# EAGLE design emonBike v0.2 (EAGLE 7.7.0)
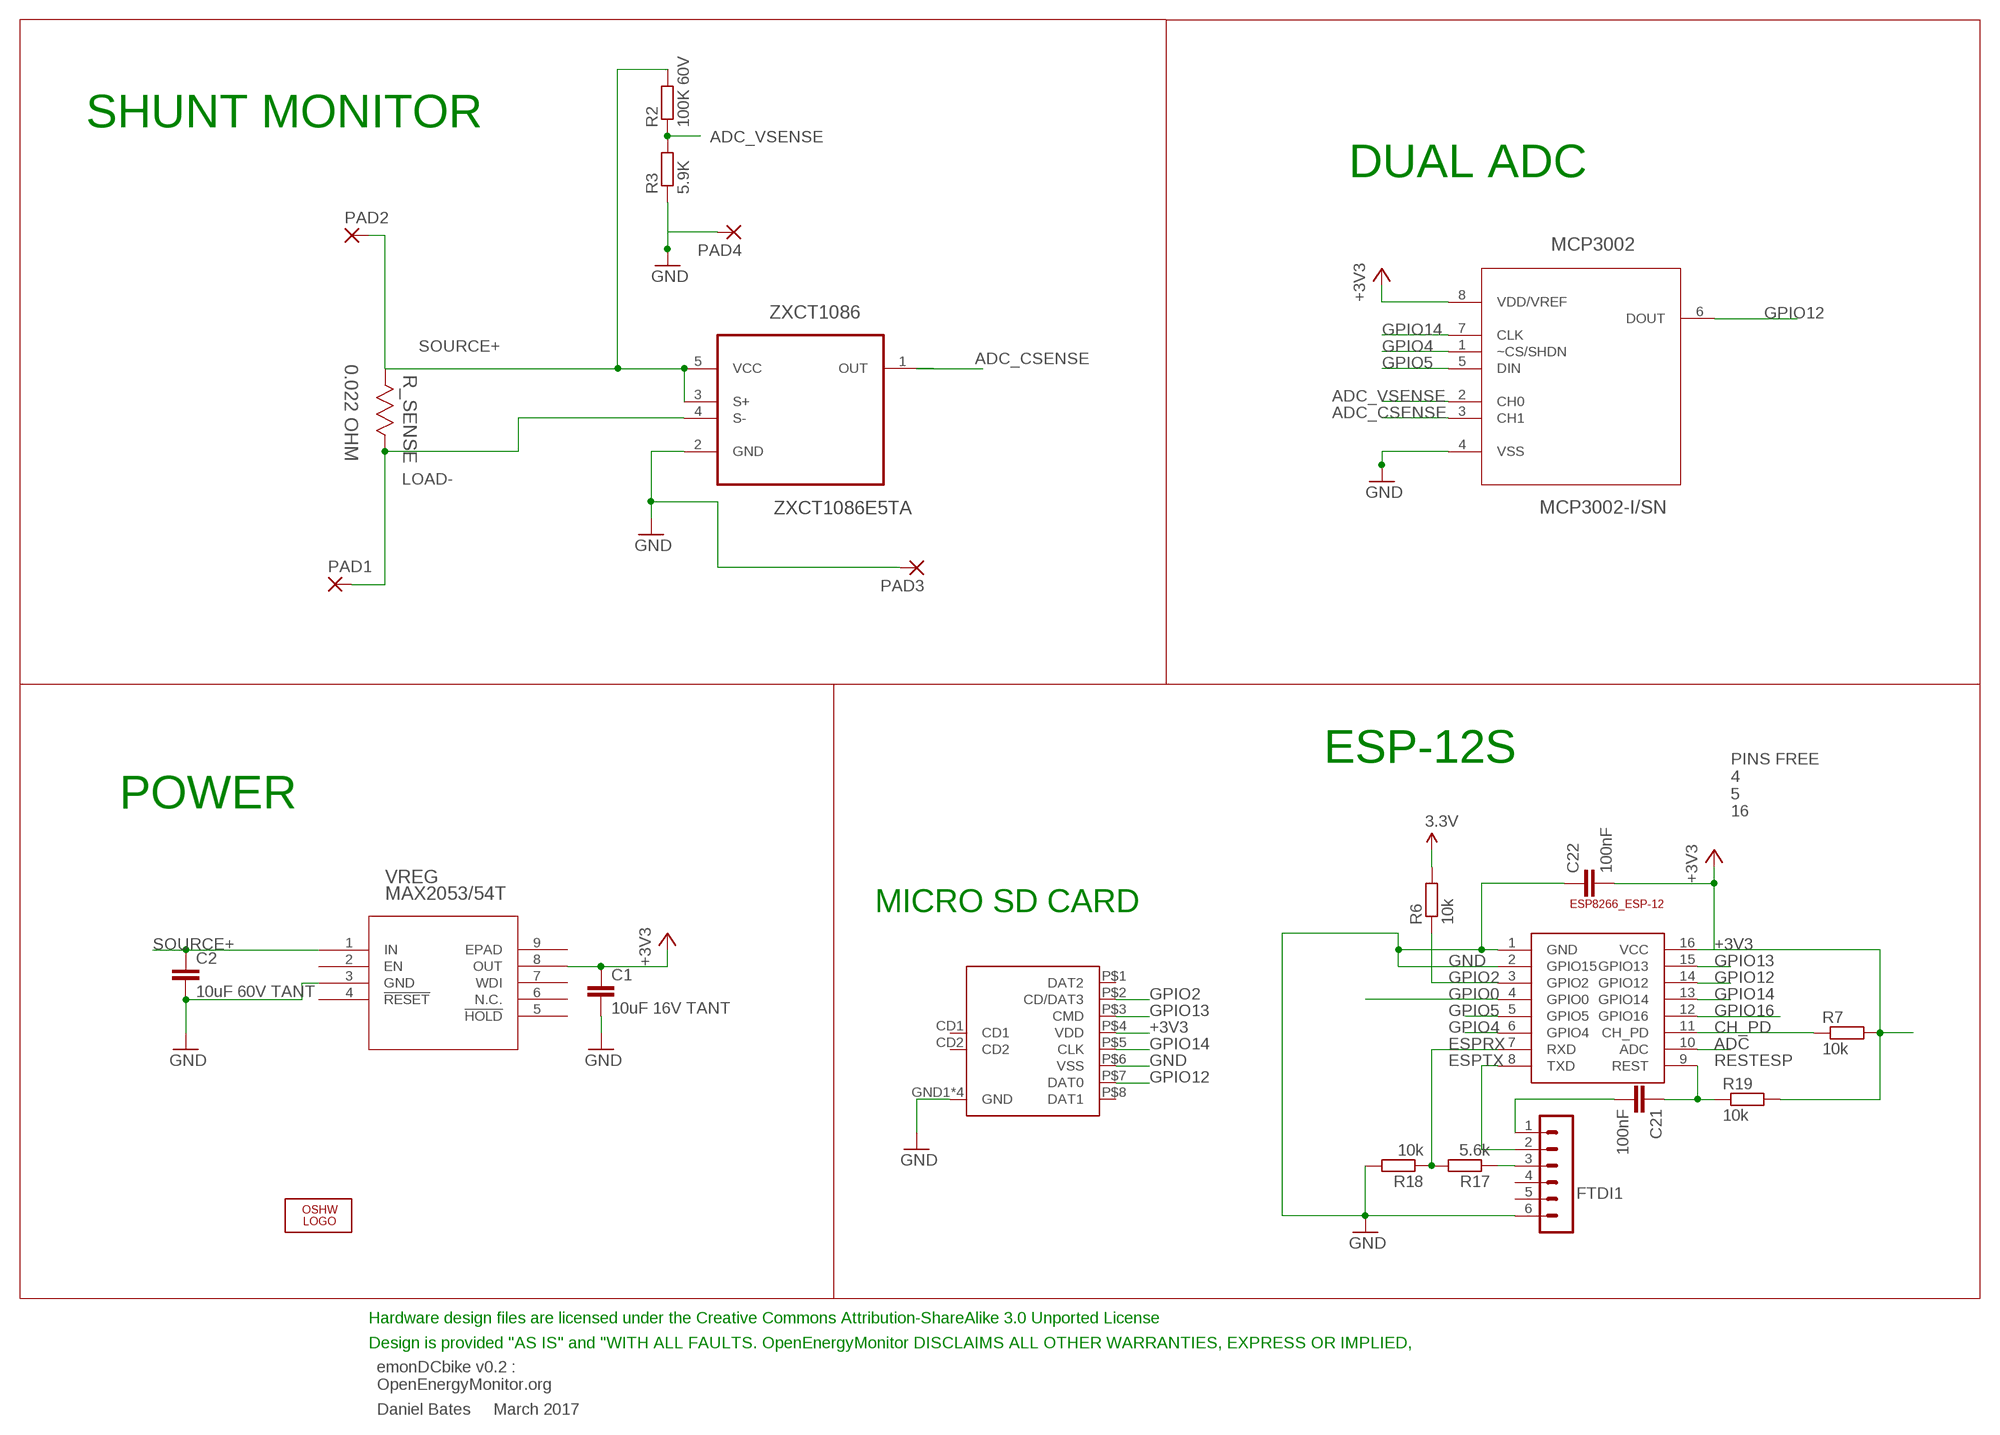
[diagram p0: schematic, sheet 1]

## Parts
C1  10uF 16V TANT  C-EUC0603  [C0603]
C2  10uF 60V TANT  C-EUC0603  [C0603]
C21  100nF  C-EUC0603  [C0603]
C22  100nF  C-EUC0603  [C0603]
ESP-12  ESP8266_ESP-12  [ESP8266-ESP12]
FTDI1  FTDI-ESP  MA06-1  [MA06-1]
LOGO1  OSHW_LOGO_6MILX0200-NT  [OSHW_6X200_NOTEXT]
MAX2053  MAX5023TASA-T  [21-0111D_SBE-14]
MCP3002  MCP3002-I/SN  [SOIC127P600X175-8N]
PAD1  3,81/1,4  [3,81/1,4]
PAD2  3,81/1,4  [3,81/1,4]
PAD3  3,81/1,4  [3,81/1,4]
PAD4  3,81/1,4  [3,81/1,4]
R2  100K 60V  R-EU_R0603  [R0603]
R3  5.9K  R-EU_R0603  [R0603]
R6  10k  R-EU_R0603  [R0603]
R7  10k  R-EU_R0603  [R0603]
R17  5.6k  R-EU_R0603  [R0603]
R18  10k  R-EU_R0603  [R0603]
R19  10k  R-EU_R0603  [R0603]
R_SENSE  0.022 OHM  ERJ-8CWFR022V  [RESC3216X71N]
U$2  MOLEX_MICRO_SD_1040310811  [MOLEX_MICROSD_EXPOSED]
ZXCT1086  ZXCT1086E5TA  [SOT95P280X130-5N]

## Nets
+3V3: C1.1 C22.2 ESP-12.16(VCC) MAX2053.8(OUT) MCP3002.8(VDD/VREF) R6.2 R7.2 R19.2 U$2.P$4(VDD) ; supply symbol labelled 3.3V
ADC: ESP-12.10(ADC)
ADC_CSENSE: MCP3002.3(CH1) ZXCT1086.1(OUT)
ADC_VSENSE: MCP3002.2(CH0) R2.1 R3.2
CH_PD: ESP-12.11(CH_PD) R7.1
ESPRX: ESP-12.7(RXD) R17.2 R18.1
ESPTX: ESP-12.8(TXD) FTDI1.2
GND [thin_power]: C1.2 C2.2 C22.1 ESP-12.1(GND) ESP-12.2(GPIO15) FTDI1.6 MAX2053.3(GND) MCP3002.4(VSS) PAD3.1(P) PAD4.1(P) R3.1 R18.2 U$2.GND1(GND) U$2.GND2(GND) U$2.GND3(GND) U$2.GND4(GND) U$2.P$6(VSS) ZXCT1086.2(GND)
GPIO0: ESP-12.4(GPIO0)
GPIO2: ESP-12.3(GPIO2) R6.1 U$2.P$2(CD/DAT3)
GPIO4: ESP-12.6(GPIO4) MCP3002.1(~CS/SHDN)
GPIO5: ESP-12.5(GPIO5) MCP3002.5(DIN)
GPIO12: ESP-12.14(GPIO12) MCP3002.6(DOUT) U$2.P$7(DAT0)
GPIO13: ESP-12.15(GPIO13) U$2.P$3(CMD)
GPIO14: ESP-12.13(GPIO14) MCP3002.7(CLK) U$2.P$5(CLK)
GPIO16: ESP-12.12(GPIO16)
LOAD- [power]: PAD1.1(P) R_SENSE.1(R1) ZXCT1086.4(S-)
N$30: C21.2 FTDI1.1
N$36: FTDI1.3 R17.1
RESTESP: C21.1 ESP-12.9(REST) R19.1
SOURCE+ [power]: C2.1 MAX2053.1(IN) PAD2.1(P) R2.2 R_SENSE.2(R2) ZXCT1086.3(S+) ZXCT1086.5(VCC)
Unconnected: FTDI1.4 FTDI1.5 MAX2053.2(EN) MAX2053.4(!RESET) MAX2053.5(!HOLD) MAX2053.6(N.C.) MAX2053.7(WDI) MAX2053.9(EPAD) U$2.CD1 U$2.CD2 U$2.P$1(DAT2) U$2.P$8(DAT1)

## Notes on the sheet
- SHUNT MONITOR
- DUAL ADC
- ESP-12S
- POWER
- PINS FREE
  4
  5
  16
- MICRO SD CARD
- Hardware design files are licensed under the Creative Commons Attribution-ShareAlike 3.0 Unported License
- Design is provided "AS IS" and "WITH ALL FAULTS. OpenEnergyMonitor DISCLAIMS ALL OTHER WARRANTIES, EXPRESS OR IMPLIED,
- emonDCbike v0.2 :
  OpenEnergyMonitor.org
- Daniel Bates     March 2017

## Library data of the parts
C1 C2 C21 C22 = rcl:C-EU: CAPACITOR, European symbol
ESP-12 = ESP8266-ESP12:ESP8266_ESP-12
FTDI1 = JeeLabs:MA06-1: PIN HEADER
LOGO1 = ohw-logo:OSHW_LOGO_6MIL; OC_FARNELL: unknown
MAX2053 = MAX2053:MAX5023TASA-T: VOLTAGE REGULATOR 3.3V; MANUFACTURER_PART_NUMBER: max5023tasat; VENDOR: MAXIM
MCP3002 = Microchip-MCP3002-I_SN:MCP3002-I/SN: Dual Channel 10-Bit A/D Converter; DESCRIPTION: Dual Channel 10-Bit A/D Converter; MPN: MCP3002-I/SN; OC_FARNELL: 1834969; OC_NEWARK: 59K0225; PACKAGE: SOIC-8; SUPPLIER: Microchip
PAD1-PAD4 = wirepad:3,81/1,4: THROUGH-HOLE PAD
R2 = rcl:R-EU_: RESISTOR, European symbol; MPN: MCWR06X1003FTL
R3 = rcl:R-EU_: RESISTOR, European symbol; MPN: MCWR06X5901FTL
R6 R7 R17-R19 = rcl:R-EU_: RESISTOR, European symbol
R_SENSE = Panasonic-ERJ3_ERJ8_ERJA_ERJB:ERJ-8C: Thick Film Chip Resistors/Low Resistance Type ,1206, 0.5W, ±1 %; MPN: ERJ-8CWFR022V; OC_FARNELL: 2145292; OC_NEWARK: 28W1688; PACKAGE: 1206; POWERRATING: 1W; SUPPLIER: PANASONIC; TOLERANCE: ± 1 %
U$2 = MOLEX MICRO SD [exposed pins]:MOLEX_MICRO_SD_1040310811
ZXCT1086 = Diodes_Inc-ZXCT1086E5TA:ZXCT1086E5TA: PRECISION HIGH VOLTAGE HIGH-SIDE CURRENT MONITORS; MPN: ZXCT1086E5TA; OC_FARNELL: 1904029; OC_NEWARK: 55T4046; PACKAGE: SOT-25-5; SUPPLIER: DIODES INC.

## Net classes
1 power: width 1.016 mm
2 thin_power: width 0.254 mm

## Board
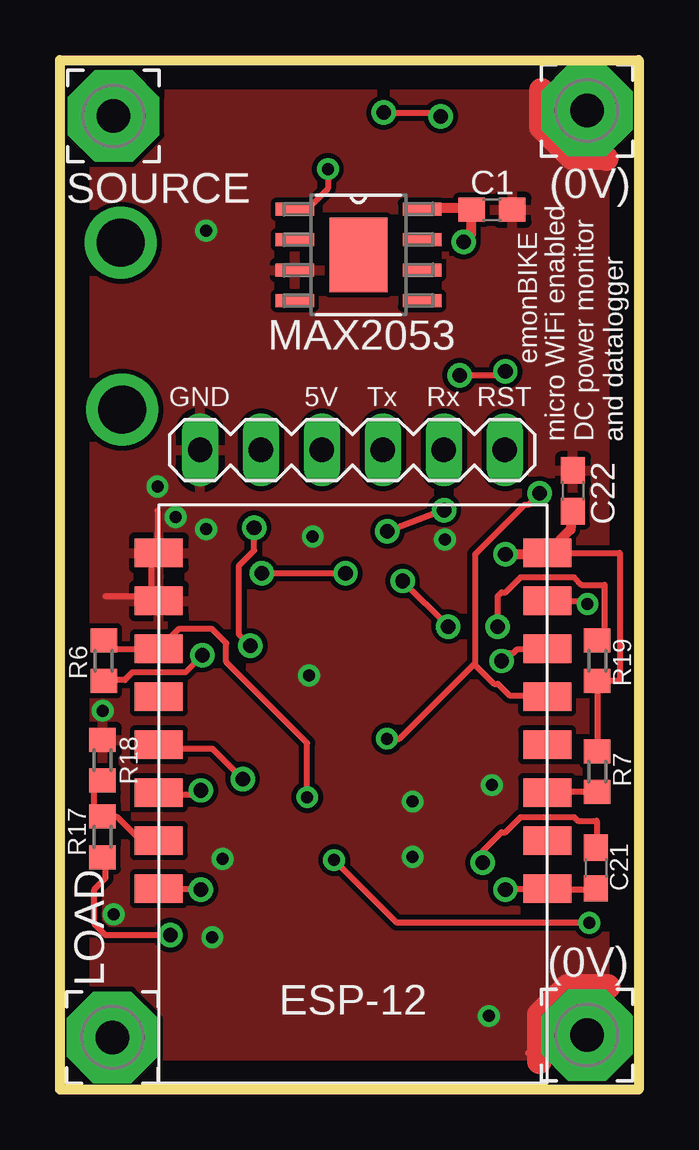
[diagram p1: board, top side]
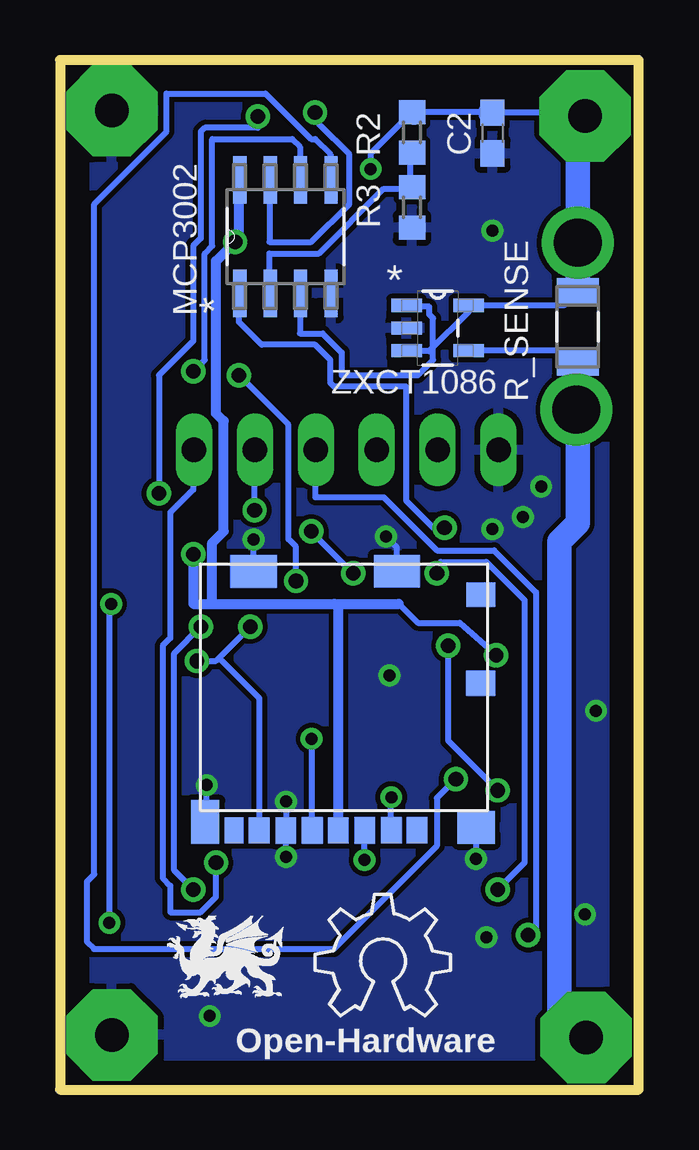
[diagram p2: board, bottom side, seen from below]

Size 24.13 x 42.93 mm. Coordinates in mm from the lower left corner, seen from the top.
Outline: 0,42.93 24.13,42.93 24.13,0 0,0 0,42.93
Copper layers (1*16): Top 0.035mm / dielectric 1.5mm / Bottom 0.035mm
Design rules "default": minimum track width 10mil, minimum drill 24mil, track to track 8mil, track to pad 8mil, pad to pad 8mil, via to via 8mil, smd to smd 8mil, copper to edge 40mil, drill to drill 8mil, minimum pad ring 10mil, minimum via ring 8mil, stop-mask expansion 4mil, vias tented up to drill 0mil, thermal gap 10mil

### Footprints (pad centres in the part's own frame; a part is rotated, then mirrored left to right if it is on the bottom)
C0603 = smd 1.1 x 1: 1 -0.85,0; 2 0.85,0
ESP8266-ESP12 = smd 2 x 1.2: 1 16.2,2; 2 16.2,4; 3 16.2,6; 4 16.2,8; 5 16.2,10; 6 16.2,12; 7 16.2,14; 8 16.2,16; 9 0,16; 10 0,14; 11 0,12; 12 0,10; 13 0,8; 14 0,6; 15 0,4; 16 0,2
MA06-1 = drill 1.016 long: 1 0,0; 2 2.54,0; 3 5.08,0; 4 7.62,0; 5 10.16,0; 6 12.7,0
21-0111D_SBE-14 = smd 1.6 x 0.533: 1 -2.654,1.905; 2 -2.654,0.635; 3 -2.654,-0.635; 4 -2.654,-1.905; 5 2.654,-1.905; 6 2.654,-0.635; 7 2.654,0.635; 8 2.654,1.905 | smd 2.413 x 3.099: 9 0,0
SOIC127P600X175-8N = smd 1.981 x 0.559: 1 -2.362,1.905; 2 -2.362,0.635; 3 -2.362,-0.635; 4 -2.362,-1.905; 5 2.362,-1.905; 6 2.362,-0.635; 7 2.362,0.635; 8 2.362,1.905
3,81/1,4 = drill 1.397 pad 3.81 octagon: 1 0,0
R0603 = smd 1 x 1.1: 1 -0.85,0; 2 0.85,0
RESC3216X71N = smd 1.118 x 1.753: 1 -1.473,0; 2 1.473,0
MOLEX_MICROSD_EXPOSED = smd 1.195 x 1.005: CD1 5.349,0.435; CD2 5.349,4.135 | smd 1.907 x 1.348: GND1 -4.112,5.104; GND2 1.853,5.104 | smd 1.17 x 1.793: GND3 -6.134,-5.352 | smd 1.551 x 1.348: GND4 5.167,-5.577 | smd 0.851 x 1.092: P$1 2.707,-5.703; P$2 1.617,-5.703; P$3 0.522,-5.699; P$4 -0.586,-5.701; P$5 -1.676,-5.703; P$6 -2.769,-5.703; P$7 -3.875,-5.701 | smd 0.749 x 1.092: P$8 -4.935,-5.701
SOT95P280X130-5N = smd 1.27 x 0.559: 1 -1.295,0.94; 2 -1.295,0; 3 -1.295,-0.94; 4 1.295,-0.94; 5 1.295,0.94

### Placement (x,y rotation side)
C1  18.01,36.68 0 top
C2  6.1,39.88 270 bottom
C21  22.35,9.25 90 top
C22  21.39,24.97 270 top
ESP-12  20.32,24.38 180 top
FTDI1  18.54,26.67 180 top
LOGO1  13.5,3.07 0 bottom
MAX2053  12.45,34.8 0 top
MCP3002  14.73,35.56 90 bottom
PAD1  2.18,2.18 0 top
PAD2  2.24,40.59 0 top
PAD3  21.97,2.29 0 top
PAD4  21.97,40.82 0 top
R2  9.45,39.9 90 bottom
R3  9.45,36.78 90 bottom
R6  1.83,17.88 270 top
R7  22.4,13.26 90 top
R17  1.78,10.54 90 top
R18  1.78,13.74 90 top
R19  22.4,17.88 270 top
R_SENSE  2.54,31.8 90 bottom
U$2  11.94,16.51 0 bottom
U$3  [DRAGON_LOGO_NOTEXT]  17.07,5.51 0 bottom
ZXCT1086  8.38,31.75 0 bottom

### Tracks (layer width: path | path; a pad name or v marks a point on that pad's centre or on a via)
+3V3  (via drill 0.61)
  Top 0.254: R7.2 R19.2 23.34,17.04 23.34,22.38 ESP-12.16 20.16,22.32 | 16.83,36.77 17.15,36.77 C1.1 16.83,36.77 | 15.24,36.77 MAX2053.8 | 16.83,36.77 17.15,36.45 | v5.94,18.12 6.03,18.03 5.87,18.03 5.24,17.4 3.02,17.4 2.7,17.08 1.91,17.08 R6.2
  Top 0.406: C22.2 21.29,23.35 ESP-12.16 | 15.24,36.77 16.83,36.77 | v16.83,35.34 17.15,35.66 17.15,36.45 | 20.16,22.32 v18.57,22.32
  Bottom 0.254: 16.67,37.88 MCP3002.8 | v5.94,18.12 7.46,19.46 9.21,19.46 10,20.26 | 12.52,20.08 12.7,20.26
  Bottom 0.406: 16.67,37.88 16.67,35.5 v16.83,35.34 17.62,34.54 17.62,28.19 17.3,27.88 17.3,23.27 17.78,22.8 17.78,20.26 | 17.78,20.26 18.57,20.26 v18.57,22.32 | 17.78,20.26 12.7,20.26 10,20.26 | U$2.P$4 12.52,20.08
ADC_CSENSE
  Bottom 0.254: ZXCT1086.1 9.53,32.64 8.73,32.64 8.73,32.32 8.57,32.16 8.57,30.42 9.21,29.78 12.38,29.78 12.38,30.73 13.18,31.53 14.13,31.53 14.13,33.12 MCP3002.3
ADC_VSENSE
  Bottom 0.254: R2.1 9.53,38.99 9.53,37.72 R3.2 9.53,37.56 10.64,37.56 13.34,34.86 15.4,34.86 15.4,33.27 MCP3002.2
CH_PD
  Top 0.254: R7.1 20.32,12.41 ESP-12.11
ESPRX
  Top 0.254: ESP-12.7 arc90 ESP-12.7 3.97,10.41 3.33,10.41 2.38,11.37 1.91,11.37 R17.2 1.75,11.37 1.43,11.37 1.43,12.48 1.75,12.79 R18.1
ESPTX  (via drill 0.61)
  Top 0.254: v5.87,8.35 4.13,8.35 ESP-12.8 | v11.91,21.53 v8.41,21.53 | v16.02,24.16 v13.65,23.27
  Bottom 0.254: v5.87,8.35 4.76,9.46 4.76,20.41 6.35,22 8.26,22 8.26,21.68 v8.41,21.53 | v13.65,23.27 v11.91,21.53 | v16.02,24.16 16.03,24.26 16.03,26.61 FTDI1.2
GND  (via drill 0.5)
  Top 0.254: 4.06,24.13 4.06,22.35 | ESP-12.1 3.81,21.84 3.81,20.38 ESP-12.2 4.12,20.57 1.91,20.57 | 22.07,38.83 22.07,38.86 | 19.53,1.52 19.99,1.52
  Top 1.016: 20.07,41.66 20.07,40.13 21.34,38.86 22.07,38.86 22.73,38.86 22.78,38.81 | 19.99,1.17 19.99,1.52 19.99,3.15 21.16,4.32 22.84,4.32 22.86,4.29
  Bottom 0.254: U$2.GND4 6.78,10.92 v6.78,9.63 | v14.71,12.01 | v14.71,12.01 U$2.P$6 | U$2.GND3 18.01,11.22 v18.01,12.7 | 14.73,10.92 14.73,9.7 | U$2.GND2 10.09,22.61 v10.54,23.06 | U$2.GND1 v16.05,22.93 v16.05,22.94
  other vias: 6.35,6.35 2.24,7.32 1.78,15.8 4.83,23.88 17.88,3.07 6.1,23.37 4.06,25.15 14.71,9.7 10.39,17.27 6.1,35.81
  pour Top: 0.25,42.67 23.88,42.67 23.88,0.25 0.25,0.25
  pour Bottom: 0.25,42.67 23.88,42.67 23.88,0.25 0.25,0.25
GPIO2  (via drill 0.5)
  Top 0.254: R6.1 1.84,18.38 ESP-12.3 4.94,19.2 6.35,19.2 6.93,18.62 6.93,17.83 10.31,14.45 v10.31,12.19
  Bottom 0.254: U$2.P$2 10.32,12.18 v10.31,12.19
GPIO4  (via drill 0.61)
  Top 0.254: v8.1,23.43 8.1,22.48 7.46,21.84 7.46,18.99 v7.94,18.51 | v5.87,12.48 5.72,12.32 4.13,12.32 ESP-12.6
  Bottom 0.254: v8.1,23.43 8.57,23.43 9.68,24.54 9.68,29.3 12.7,29.3 12.86,29.46 12.86,30.42 13.49,31.05 15.72,31.05 16.67,32 16.67,33.12 MCP3002.1 | v7.94,18.51 7.94,14.54 v5.87,12.48
GPIO5  (via drill 0.61)
  Top 0.254: v7.62,12.95 6.35,14.22 5.08,14.22 4.92,14.38 ESP-12.5
  Bottom 0.254: v7.62,12.95 8.41,12.16 8.41,10.16 12.71,5.87 22.71,5.87 23.01,6.17 23.01,8.67 22.7,8.99 22.7,36.92 19.69,39.94 19.69,41.53 15.56,41.53 13.65,39.62 13.49,39.62 12.86,38.99 12.86,38.04 MCP3002.5
GPIO12  (via drill 0.61)
  Top 0.254: v18.57,29.94 18.42,29.78 v16.67,29.78 | v16.19,19.3 v14.29,21.21 | v18.42,17.88 18.73,18.19 18.89,18.19 19.05,18.35 20.32,18.35 ESP-12.14
  Bottom 0.254: v18.57,29.94 18.1,30.42 18.1,34.86 17.78,35.18 17.78,39.62 14.45,39.62 14.13,39.31 14.13,38.04 MCP3002.6 | v16.67,29.78 14.61,27.72 14.61,22.95 14.29,22.64 v14.29,21.21 | 17.49,18 17.62,17.88 v18.42,17.88 | 17.49,18 v16.19,19.3 | U$2.P$7 15.81,16.32 17.49,18
GPIO13  (via drill 0.5)
  Top 0.254: ESP-12.15 22.06,20.38 v22,20.24 | v22.07,6.96 14.05,6.96 v11.43,9.58
  Bottom 0.254: v11.43,9.58 11.43,10.8 U$2.P$3 | v22,20.24 22.07,20.17 v22.07,6.96
GPIO14  (via drill 0.5, 0.61)
  Top 0.254: 17.3,17.78 17.3,22.32 19.37,24.38 19.53,24.38 v20,24.86 | 17.3,17.78 17.3,17.72 18.1,16.92 18.26,16.92 18.73,16.45 20.32,16.45 ESP-12.13 | v15.88,40.58 15.72,40.73 v13.49,40.73 | v13.64,14.63 14.15,14.63 17.3,17.78
  Bottom 0.254: v20,24.86 20,29.78 18.57,31.21 18.57,35.18 18.26,35.5 18.26,39.94 18.1,40.1 15.88,40.1 v15.88,40.58 | v13.49,40.73 13.34,40.58 13.34,40.26 12.07,38.99 12.07,36.92 13.65,35.34 15.4,35.34 15.4,37.88 MCP3002.7 | U$2.P$5 13.61,14.6 v13.64,14.63
LOAD-
  Bottom 0.254: R_SENSE.1 3.02,30.81 ZXCT1086.4
  Bottom 1.016: PAD1.1 2.54,2.18 3.3,2.95 3.3,22.86 2.54,23.62 R_SENSE.1
N$1  (via drill 2)
  other vias: 2.59,28.35
N$2  (via drill 2)
  other vias: 2.54,35.31
N$30  (via drill 0.61)
  Top 0.254: v17.62,9.46 17.62,9.94 18.42,10.73 18.57,10.73 19.21,11.37 21.43,11.37 21.59,11.21 22.38,11.21 22.38,10.1 C21.2
  Bottom 0.254: v17.62,9.46 17.62,8.03 18.26,7.4 19.53,7.4 19.53,8.51 19.84,8.83 19.84,18.51 19.53,18.83 19.53,24.07 18.57,25.02 18.57,26.61 FTDI1.1
N$36  (via drill 0.61)
  Top 0.254: v4.6,6.45 1.91,6.45 1.43,6.92 1.43,8.35 1.91,8.83 1.91,9.62 R17.1
  Bottom 0.254: v4.6,6.45 4.29,6.76 4.29,20.73 6.03,22.48 8.41,22.48 10.64,24.7 13.49,24.7 13.49,26.61 FTDI1.3
RESTESP  (via drill 0.61)
  Top 0.254: 20.32,8.35 22.23,8.35 C21.1 | v18.26,19.3 18.26,20.57 18.42,20.73 18.57,20.73 19.21,21.37 21.43,21.37 21.75,21.05 22.7,21.05 22.7,18.99 22.54,18.83 R19.1 | 20.32,8.35 v18.57,8.35 | 20.32,8.35 ESP-12.9
  Bottom 0.254: v18.26,19.3 19.37,18.19 19.37,9.14 v18.57,8.35
SOURCE+  (via drill 0.5)
  Top 0.254: v11.18,38.38 11.18,37.57 10.36,36.75 9.84,36.75 MAX2053.1
  Bottom 0.254: R_SENSE.2 3.12,32.69 ZXCT1086.5 7.09,32.44 8.74,30.78 9.65,30.78 ZXCT1086.3 | 2.54,40.28 2.98,40.73 C2.1 | 6.19,40.73 6.21,40.75 R2.2 11.18,39.03 v11.18,38.38
  Bottom 1.016: R_SENSE.2 2.54,40.28 PAD2.1 | 9.37,40.73 R2.2 | 6.19,40.73 C2.1

### Text on the board
bPlace: Open-Hardware
tNames: (0V) | SOURCE | emonBIKE | GND | 5V | Tx | Rx | RST | micro WiFi enabled / DC power monitor / and datalogger | LOAD | (0V)
tSilk: GND | 5V | Tx | Rx | RST | emonDC | Wireless Energy / Monitoring Node | v0.4 Jan 2017 by DB
_tsilk: Designed in | North Wales | Made in UK
_bsilk: SMT V0.6 rev3 | emonTx | wireless energy monitoring node | SMT V0.6 rev3 | emonTx | SMT V0.6 rev3 | emonTx | Technology that helps us live within ecological limits | wireless energy monitoring node | wireless energy monitoring node | Designed in North Wales UK by Glyn Hudson & Trystan Lea | Technology that helps us live within ecological limits | Technology that helps us live within ecological limits | Designed in North Wales UK by Glyn Hudson & Trystan Lea | 165mm ant | 433Mhz | Designed in North Wales UK by Glyn Hudson & Trystan Lea | 165mm ant | 165mm ant | 433Mhz | 433Mhz | 868Mhz | 82mm ant | 82mm ant | 82mm ant | 868Mhz | 868Mhz | 78mm ant | 915Mhz | 78mm ant | 915Mhz | 78mm ant | 915Mhz | 165mm ant | 433Mhz | 82mm ant | 868Mhz | 78mm ant | 915Mhz